# EAGLE design motor_control_cape (EAGLE 7.7.0)

## Sheet 1 of 5
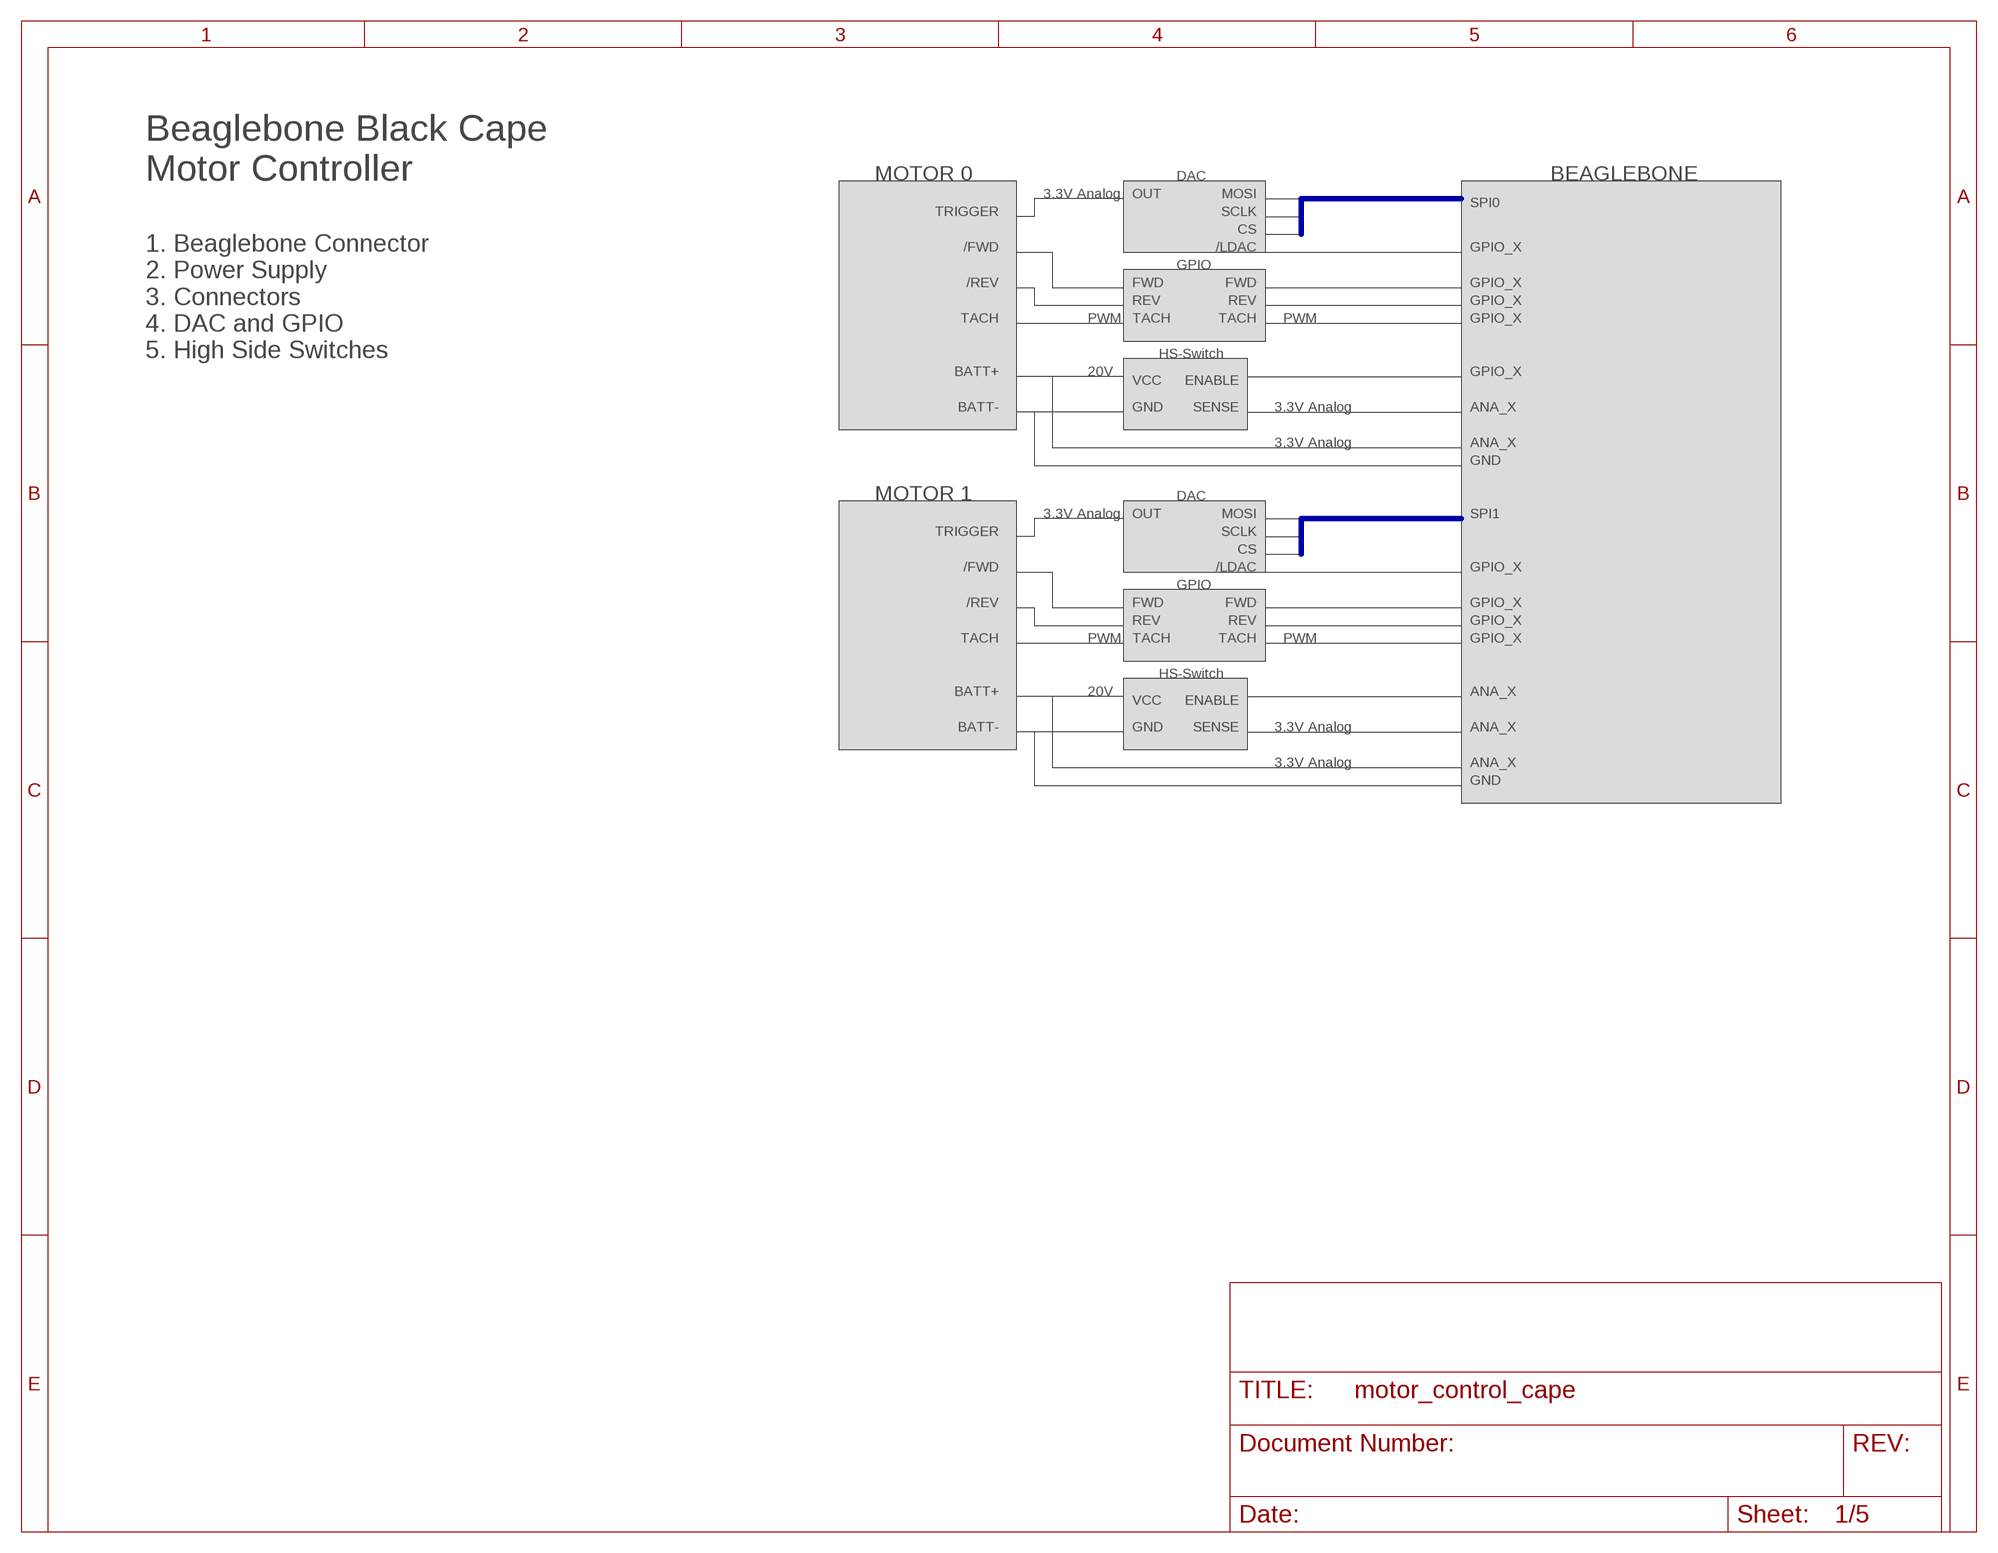
[diagram p0: schematic, sheet 1]

### Buses
B$1

### Notes on the sheet
- Beaglebone Black Cape
  Motor Controller
- MOTOR 0 | DAC | BEAGLEBONE
- 3.3V Analog | OUT | MOSI
- SPI0
- TRIGGER | SCLK
- 1. Beaglebone Connector
  2. Power Supply
  3. Connectors
  4. DAC and GPIO
  5. High Side Switches
- CS
- /FWD | /LDAC | GPIO_X
- GPIO
- /REV | FWD | FWD | GPIO_X
- REV | REV | GPIO_X
- TACH | PWM | TACH | TACH | PWM | GPIO_X
- HS-Switch
- BATT+ | 20V | GPIO_X
- VCC | ENABLE
- BATT- | GND | SENSE | 3.3V Analog | ANA_X
- 3.3V Analog | ANA_X
- GND
- MOTOR 1 | DAC
- 3.3V Analog | OUT | MOSI | SPI1
- TRIGGER | SCLK
- CS
- /FWD | /LDAC | GPIO_X
- GPIO
- /REV | FWD | FWD | GPIO_X
- REV | REV | GPIO_X
- TACH | PWM | TACH | TACH | PWM | GPIO_X
- HS-Switch
- BATT+ | 20V | ANA_X
- VCC | ENABLE
- BATT- | GND | SENSE | 3.3V Analog | ANA_X
- 3.3V Analog | ANA_X
- GND

## Sheet 2 of 5
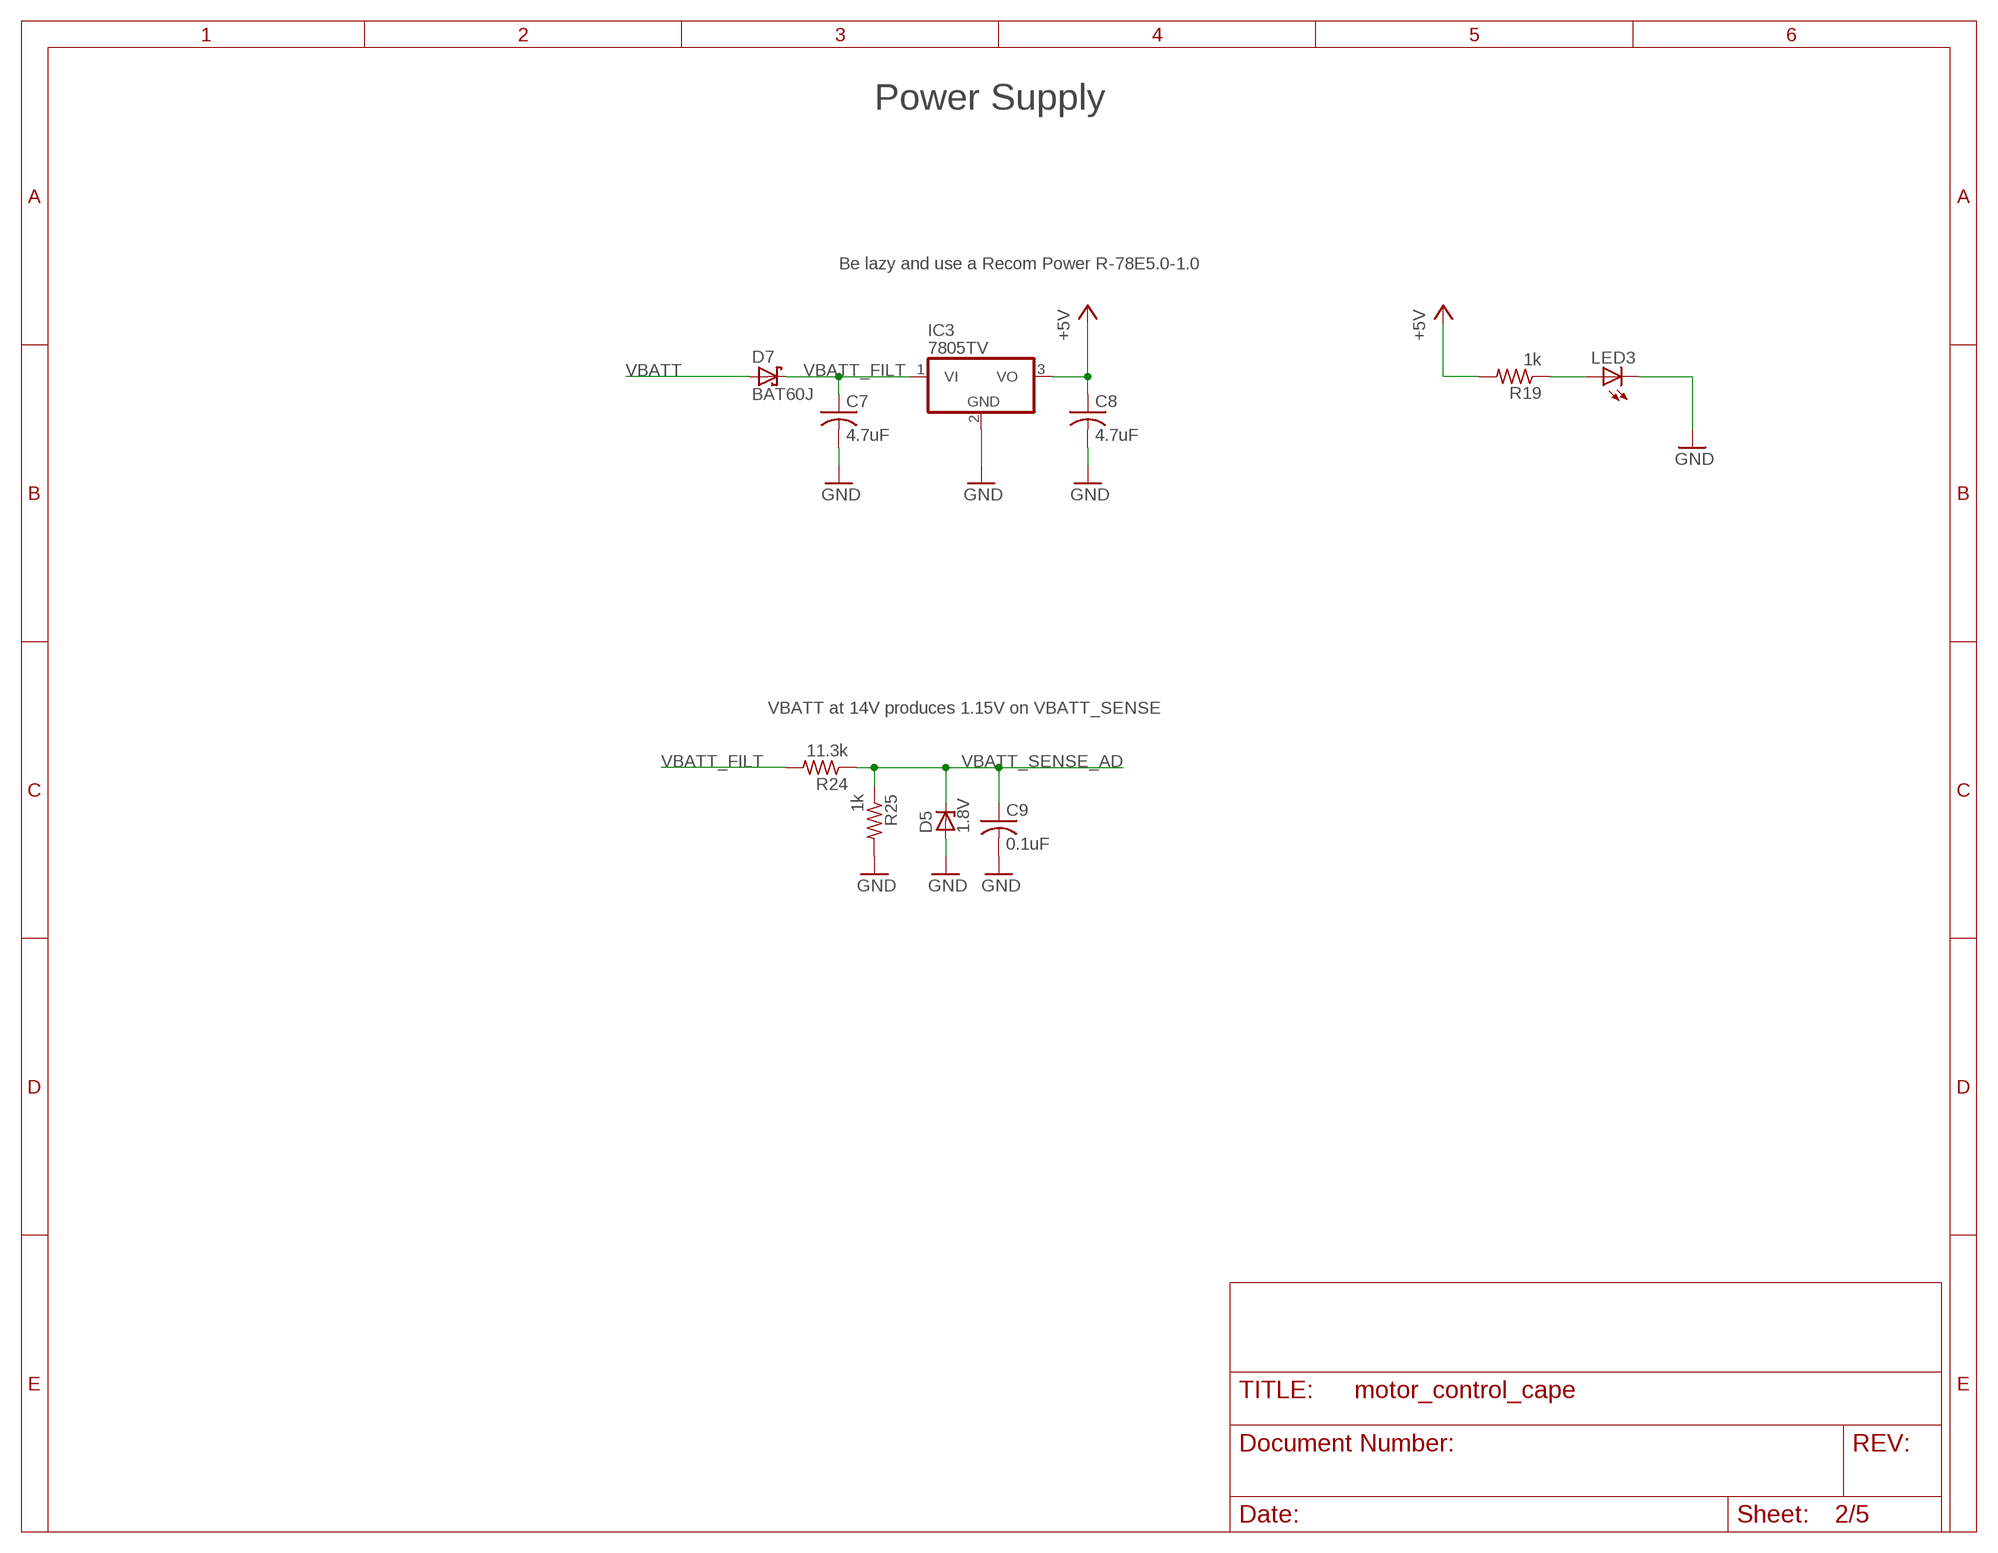
[diagram p1: schematic, sheet 2]

### Parts
C7  4.7uF  C-USC0805  [C0805]
C8  4.7uF  C-USC0805  [C0805]
C9  0.1uF  C-USC0603  [C0603]
D5  1.8V  ZENER-DIODESOT23  [SOT23]
D7  BAT60J  [SOD323_ST]
IC3  7805TV  [TO220V]
LED3  LEDCHIPLED_0603  [CHIPLED_0603]
R19  1k  R-US_R0603  [R0603]
R24  11.3k  R-US_R0603  [R0603]
R25  1k  R-US_R0603  [R0603]

### Nets
+5V: C8.1 IC3.3(VO) R19.2 ; also sheet 3
GND: C7.2 C8.2 C9.2 D5.1(A) IC3.2(GND) LED3.C R25.2 ; also sheet 3,4,5
N$7: LED3.A R19.1
VBATT: D7.A ; also sheet 3
VBATT_FILT: C7.1 D7.C IC3.1(VI) R24.2
VBATT_SENSE_AD: C9.1 D5.3(C) R24.1 R25.1 ; also sheet 3

### Notes on the sheet
- Power Supply
- Be lazy and use a Recom Power R-78E5.0-1.0
- VBATT at 14V produces 1.15V on VBATT_SENSE

## Sheet 3 of 5
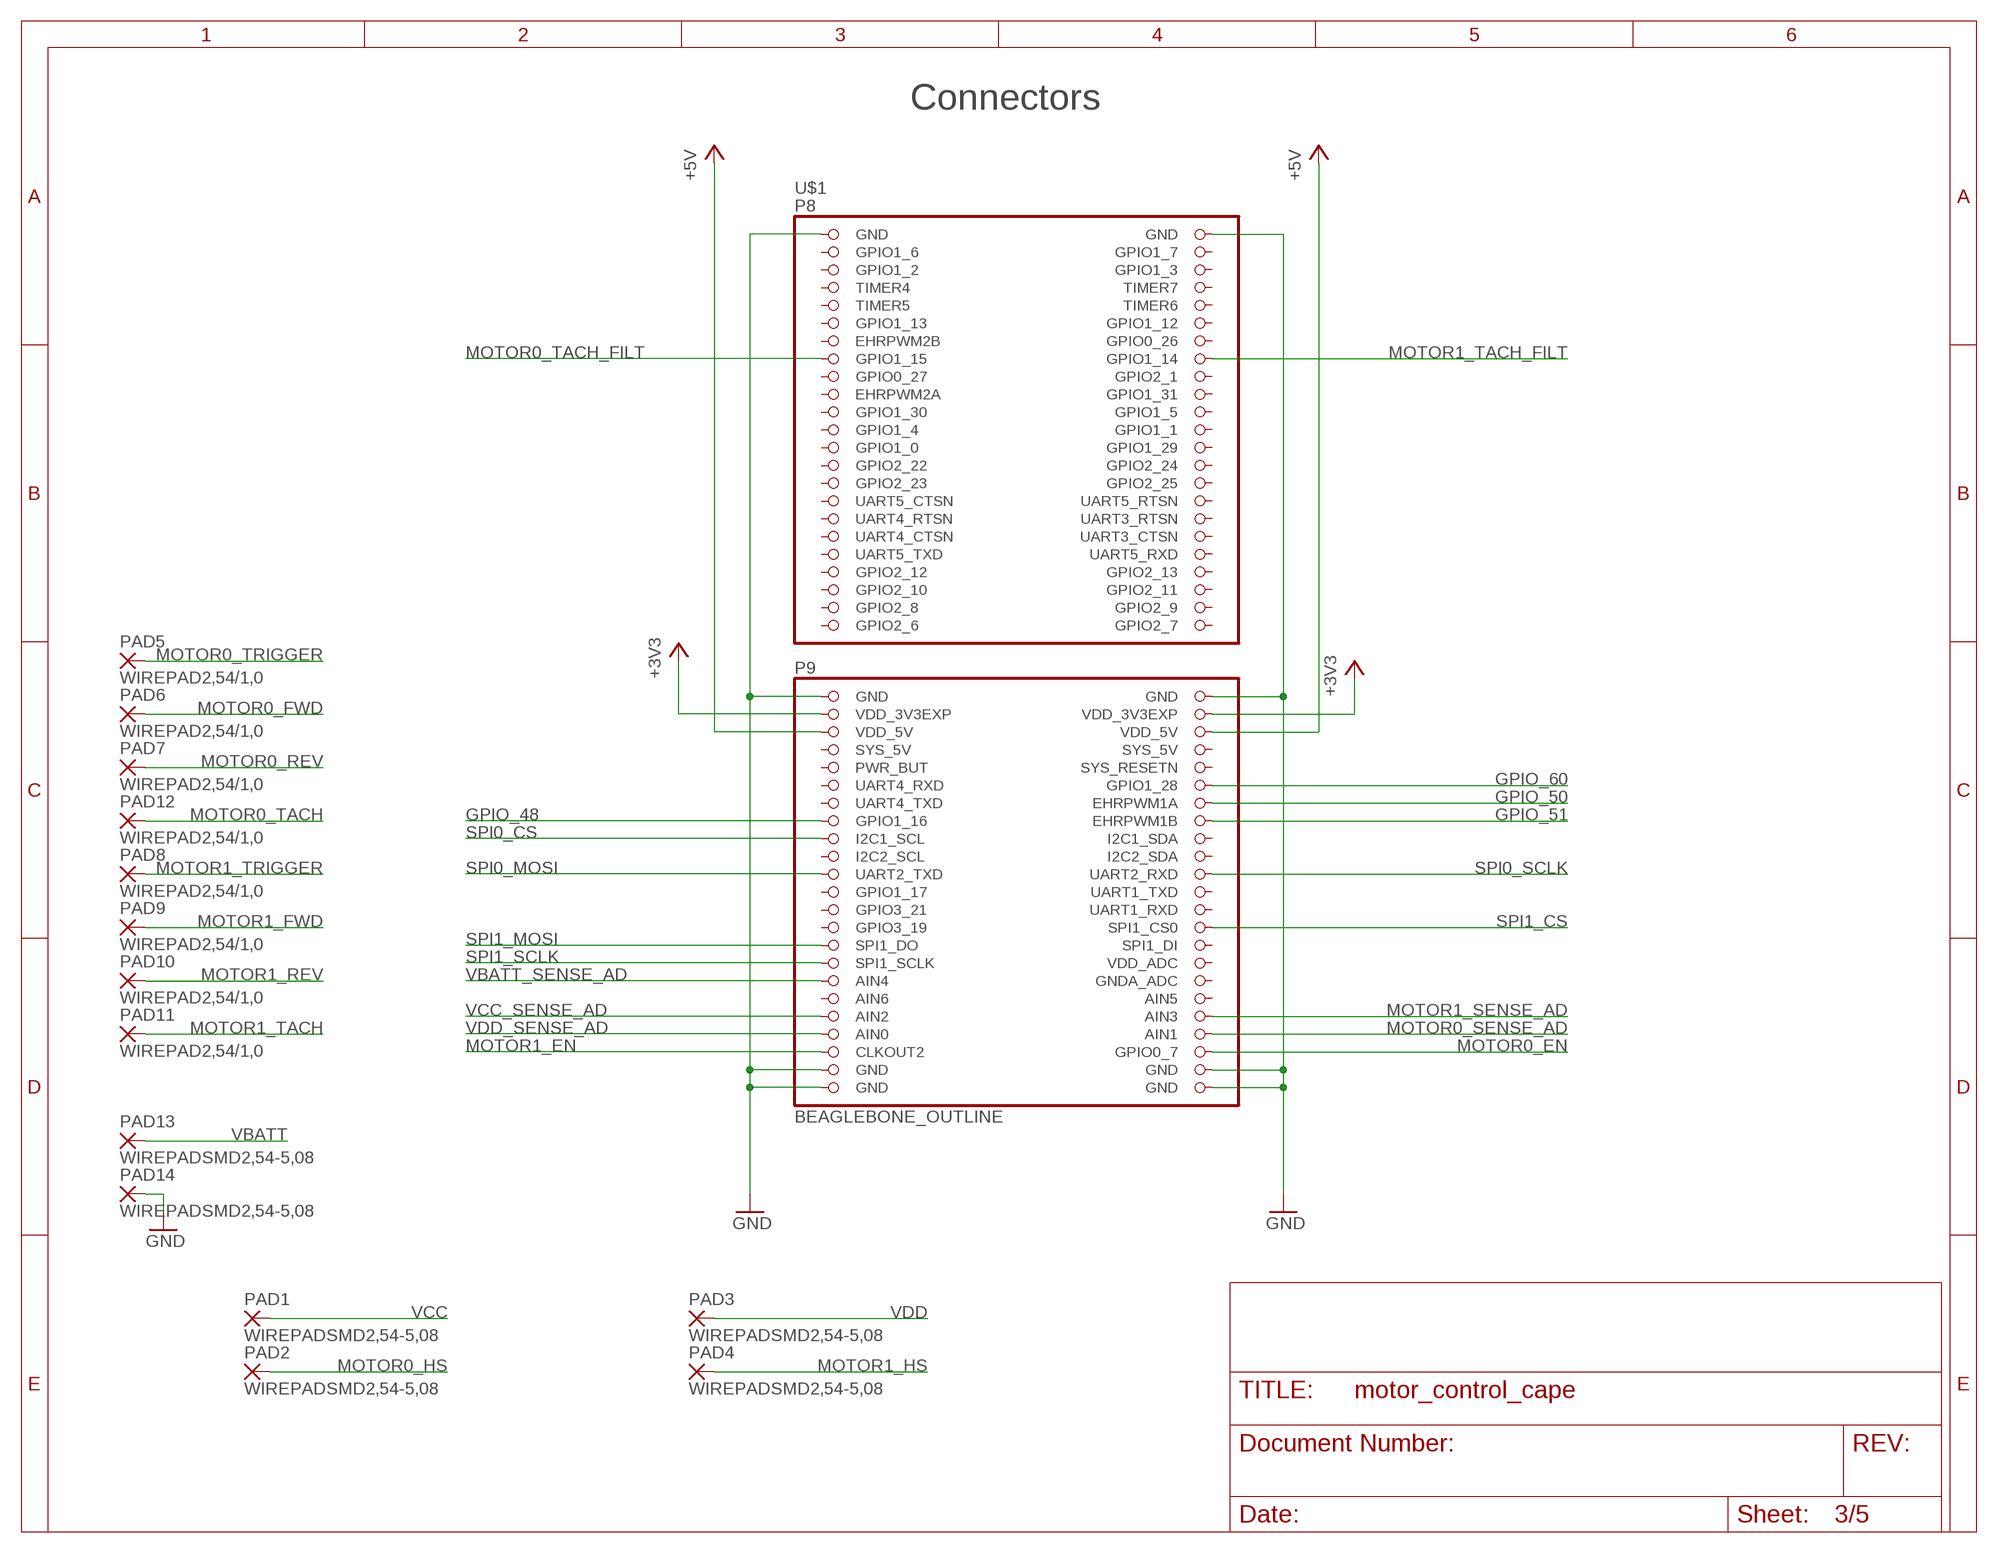
[diagram p2: schematic, sheet 3]

### Parts
PAD1  WIREPADSMD2,54-5,08  [SMD2,54-5,08]
PAD2  WIREPADSMD2,54-5,08  [SMD2,54-5,08]
PAD3  WIREPADSMD2,54-5,08  [SMD2,54-5,08]
PAD4  WIREPADSMD2,54-5,08  [SMD2,54-5,08]
PAD5  WIREPAD2,54/1,0  [2,54/1,0]
PAD6  WIREPAD2,54/1,0  [2,54/1,0]
PAD7  WIREPAD2,54/1,0  [2,54/1,0]
PAD8  WIREPAD2,54/1,0  [2,54/1,0]
PAD9  WIREPAD2,54/1,0  [2,54/1,0]
PAD10  WIREPAD2,54/1,0  [2,54/1,0]
PAD11  WIREPAD2,54/1,0  [2,54/1,0]
PAD12  WIREPAD2,54/1,0  [2,54/1,0]
PAD13  WIREPADSMD2,54-5,08  [SMD2,54-5,08]
PAD14  WIREPADSMD2,54-5,08  [SMD2,54-5,08]
U$1  BEAGLEBONE_OUTLINE  [BEAGLEBONE_SHIELD]

### Nets
+3V3: U$1.49(VDD_3V3EXP) U$1.50(VDD_3V3EXP) ; also sheet 4
+5V: U$1.51(VDD_5V) U$1.52(VDD_5V) ; also sheet 2
GND: PAD14.1(P) U$1.1(GND) U$1.2(GND) U$1.47(GND) U$1.48(GND) U$1.89(GND) U$1.90(GND) U$1.91(GND) U$1.92(GND) ; also sheet 2,4,5
GPIO_48: U$1.61(GPIO1_16) ; also sheet 4
GPIO_50: U$1.60(EHRPWM1A) ; also sheet 4
GPIO_51: U$1.62(EHRPWM1B) ; also sheet 4
GPIO_60: U$1.58(GPIO1_28) ; also sheet 4
MOTOR0_EN: U$1.88(GPIO0_7) ; also sheet 5
MOTOR0_FWD: PAD6.1(P) ; also sheet 4
MOTOR0_HS: PAD2.1(P) ; also sheet 5
MOTOR0_REV: PAD7.1(P) ; also sheet 4
MOTOR0_SENSE_AD: U$1.86(AIN1) ; also sheet 5
MOTOR0_TACH: PAD12.1(P) ; also sheet 4
MOTOR0_TACH_FILT: U$1.15(GPIO1_15) ; also sheet 4
MOTOR0_TRIGGER: PAD5.1(P) ; also sheet 4
MOTOR1_EN: U$1.87(CLKOUT2) ; also sheet 5
MOTOR1_FWD: PAD9.1(P) ; also sheet 4
MOTOR1_HS: PAD4.1(P) ; also sheet 5
MOTOR1_REV: PAD10.1(P) ; also sheet 4
MOTOR1_SENSE_AD: U$1.84(AIN3) ; also sheet 5
MOTOR1_TACH: PAD11.1(P) ; also sheet 4
MOTOR1_TACH_FILT: U$1.16(GPIO1_14) ; also sheet 4
MOTOR1_TRIGGER: PAD8.1(P) ; also sheet 4
SPI0_CS: U$1.63(I2C1_SCL) ; also sheet 4
SPI0_MOSI: U$1.67(UART2_TXD) ; also sheet 4
SPI0_SCLK: U$1.68(UART2_RXD) ; also sheet 4
SPI1_CS: U$1.74(SPI1_CS0) ; also sheet 4
SPI1_MOSI: U$1.75(SPI1_DO) ; also sheet 4
SPI1_SCLK: U$1.77(SPI1_SCLK) ; also sheet 4
VBATT: PAD13.1(P) ; also sheet 2
VBATT_SENSE_AD: U$1.79(AIN4) ; also sheet 2
VCC: PAD1.1(P) ; also sheet 5
VCC_SENSE_AD: U$1.83(AIN2) ; also sheet 5
VDD: PAD3.1(P) ; also sheet 5
VDD_SENSE_AD: U$1.85(AIN0) ; also sheet 5
Unconnected: U$1.3(GPIO1_6) U$1.4(GPIO1_7) U$1.5(GPIO1_2) U$1.6(GPIO1_3) U$1.7(TIMER4) U$1.8(TIMER7) U$1.9(TIMER5) U$1.10(TIMER6) U$1.11(GPIO1_13) U$1.12(GPIO1_12) U$1.13(EHRPWM2B) U$1.14(GPIO0_26) U$1.17(GPIO0_27) U$1.18(GPIO2_1) U$1.19(EHRPWM2A) U$1.20(GPIO1_31) U$1.21(GPIO1_30) U$1.22(GPIO1_5) U$1.23(GPIO1_4) U$1.24(GPIO1_1) U$1.25(GPIO1_0) U$1.26(GPIO1_29) U$1.27(GPIO2_22) U$1.28(GPIO2_24) U$1.29(GPIO2_23) U$1.30(GPIO2_25) U$1.31(UART5_CTSN) U$1.32(UART5_RTSN) U$1.33(UART4_RTSN) U$1.34(UART3_RTSN) U$1.35(UART4_CTSN) U$1.36(UART3_CTSN) U$1.37(UART5_TXD) U$1.38(UART5_RXD) U$1.39(GPIO2_12) U$1.40(GPIO2_13) U$1.41(GPIO2_10) U$1.42(GPIO2_11) U$1.43(GPIO2_8) U$1.44(GPIO2_9) U$1.45(GPIO2_6) U$1.46(GPIO2_7) U$1.54(SYS_5V) U$1.55(PWR_BUT) U$1.56(SYS_RESETN) U$1.57(UART4_RXD) U$1.59(UART4_TXD) U$1.64(I2C1_SDA) U$1.65(I2C2_SCL) U$1.66(I2C2_SDA) U$1.69(GPIO1_17) U$1.70(UART1_TXD) U$1.71(GPIO3_21) U$1.72(UART1_RXD) U$1.73(GPIO3_19) U$1.76(SPI1_DI) U$1.78(VDD_ADC) U$1.80(GNDA_ADC) U$1.81(AIN6) U$1.82(AIN5)

### Notes on the sheet
- Connectors

## Sheet 4 of 5
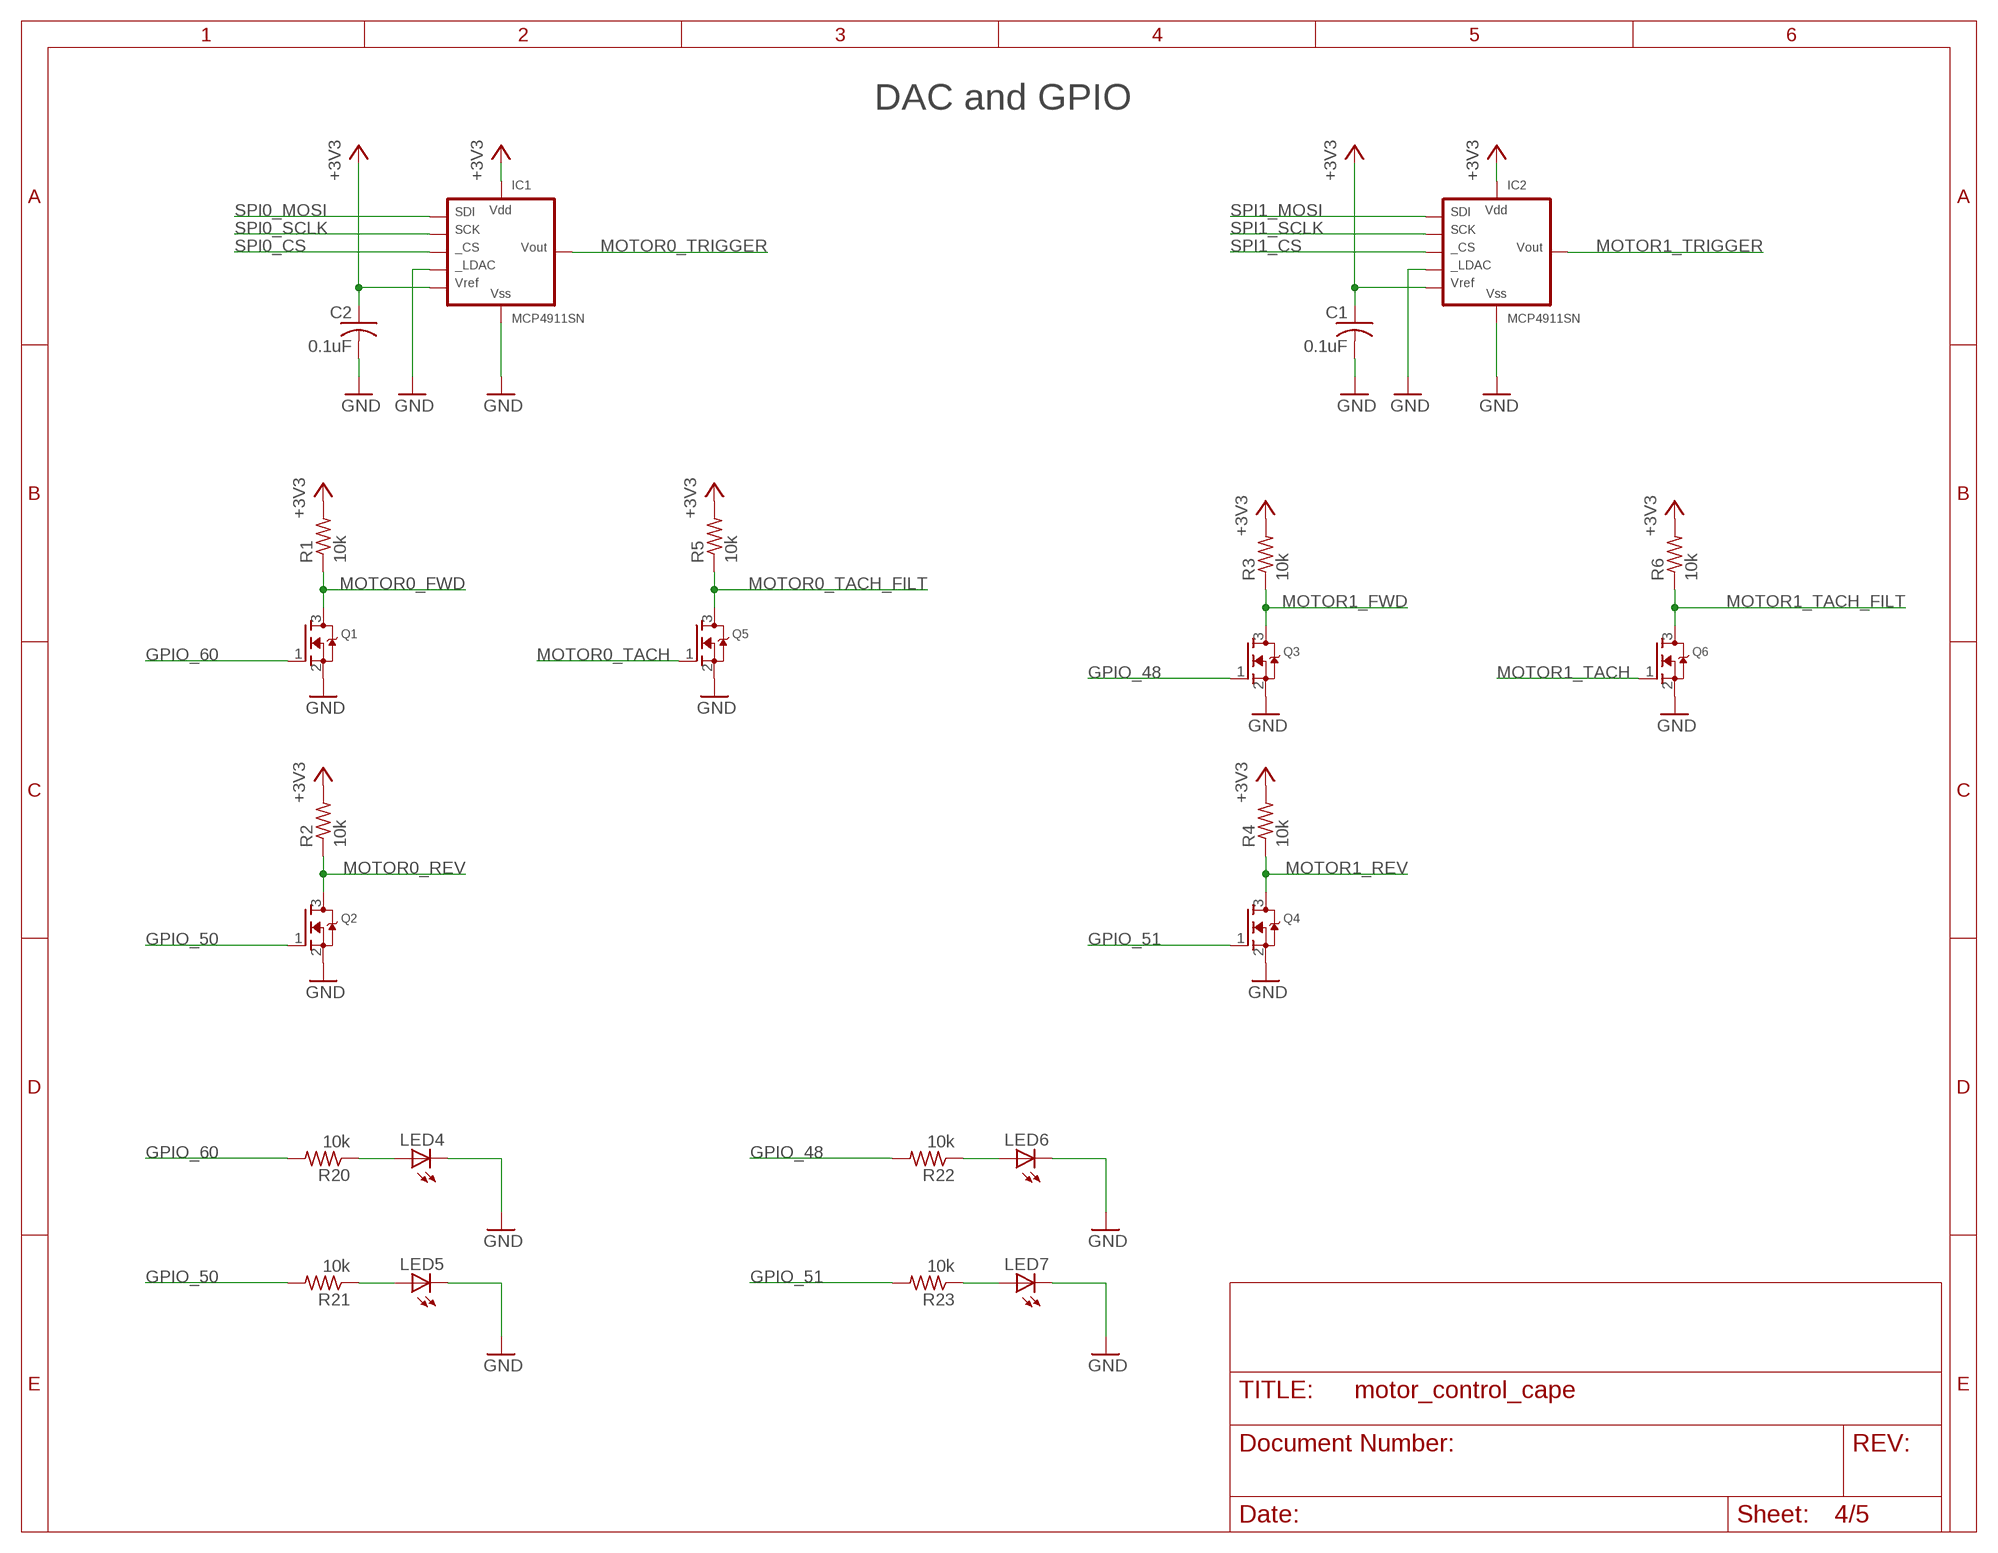
[diagram p3: schematic, sheet 4]

### Parts
C1  0.1uF  C-USC0603  [C0603]
C2  0.1uF  C-USC0603  [C0603]
IC1  MCP4911SN  [SO-08]
IC2  MCP4911SN  [SO-08]
LED4  LEDCHIPLED_0603  [CHIPLED_0603]
LED5  LEDCHIPLED_0603  [CHIPLED_0603]
LED6  LEDCHIPLED_0603  [CHIPLED_0603]
LED7  LEDCHIPLED_0603  [CHIPLED_0603]
Q1  MOSFET-NREFLOW  [SOT23]
Q2  MOSFET-NREFLOW  [SOT23]
Q3  MOSFET-NREFLOW  [SOT23]
Q4  MOSFET-NREFLOW  [SOT23]
Q5  MOSFET-NREFLOW  [SOT23]
Q6  MOSFET-NREFLOW  [SOT23]
R1  10k  R-US_R0603  [R0603]
R2  10k  R-US_R0603  [R0603]
R3  10k  R-US_R0603  [R0603]
R4  10k  R-US_R0603  [R0603]
R5  10k  R-US_R0603  [R0603]
R6  10k  R-US_R0603  [R0603]
R20  10k  R-US_R0603  [R0603]
R21  10k  R-US_R0603  [R0603]
R22  10k  R-US_R0603  [R0603]
R23  10k  R-US_R0603  [R0603]

### Nets
+3V3: C1.1 C2.1 IC1.1(VDD) IC1.6(VREF) IC2.1(VDD) IC2.6(VREF) R1.2 R2.2 R3.2 R4.2 R5.2 R6.2 ; also sheet 3
GND: C1.2 C2.2 IC1.5(LDAC) IC1.7(VSS) IC2.5(LDAC) IC2.7(VSS) LED4.C LED5.C LED6.C LED7.C Q1.2(S) Q2.2(S) Q3.2(S) Q4.2(S) Q5.2(S) Q6.2(S) ; also sheet 2,3,5
GPIO_48: Q3.1(G) R22.2 ; also sheet 3
GPIO_50: Q2.1(G) R21.2 ; also sheet 3
GPIO_51: Q4.1(G) R23.2 ; also sheet 3
GPIO_60: Q1.1(G) R20.2 ; also sheet 3
MOTOR0_FWD: Q1.3(D) R1.1 ; also sheet 3
MOTOR0_REV: Q2.3(D) R2.1 ; also sheet 3
MOTOR0_TACH: Q5.1(G) ; also sheet 3
MOTOR0_TACH_FILT: Q5.3(D) R5.1 ; also sheet 3
MOTOR0_TRIGGER: IC1.8(VOUT) ; also sheet 3
MOTOR1_FWD: Q3.3(D) R3.1 ; also sheet 3
MOTOR1_REV: Q4.3(D) R4.1 ; also sheet 3
MOTOR1_TACH: Q6.1(G) ; also sheet 3
MOTOR1_TACH_FILT: Q6.3(D) R6.1 ; also sheet 3
MOTOR1_TRIGGER: IC2.8(VOUT) ; also sheet 3
N$8: LED4.A R20.1
N$9: LED5.A R21.1
N$10: LED6.A R22.1
N$11: LED7.A R23.1
SPI0_CS: IC1.2(CS) ; also sheet 3
SPI0_MOSI: IC1.4(SDI) ; also sheet 3
SPI0_SCLK: IC1.3(SCK) ; also sheet 3
SPI1_CS: IC2.2(CS) ; also sheet 3
SPI1_MOSI: IC2.4(SDI) ; also sheet 3
SPI1_SCLK: IC2.3(SCK) ; also sheet 3

### Notes on the sheet
- DAC and GPIO

## Sheet 5 of 5
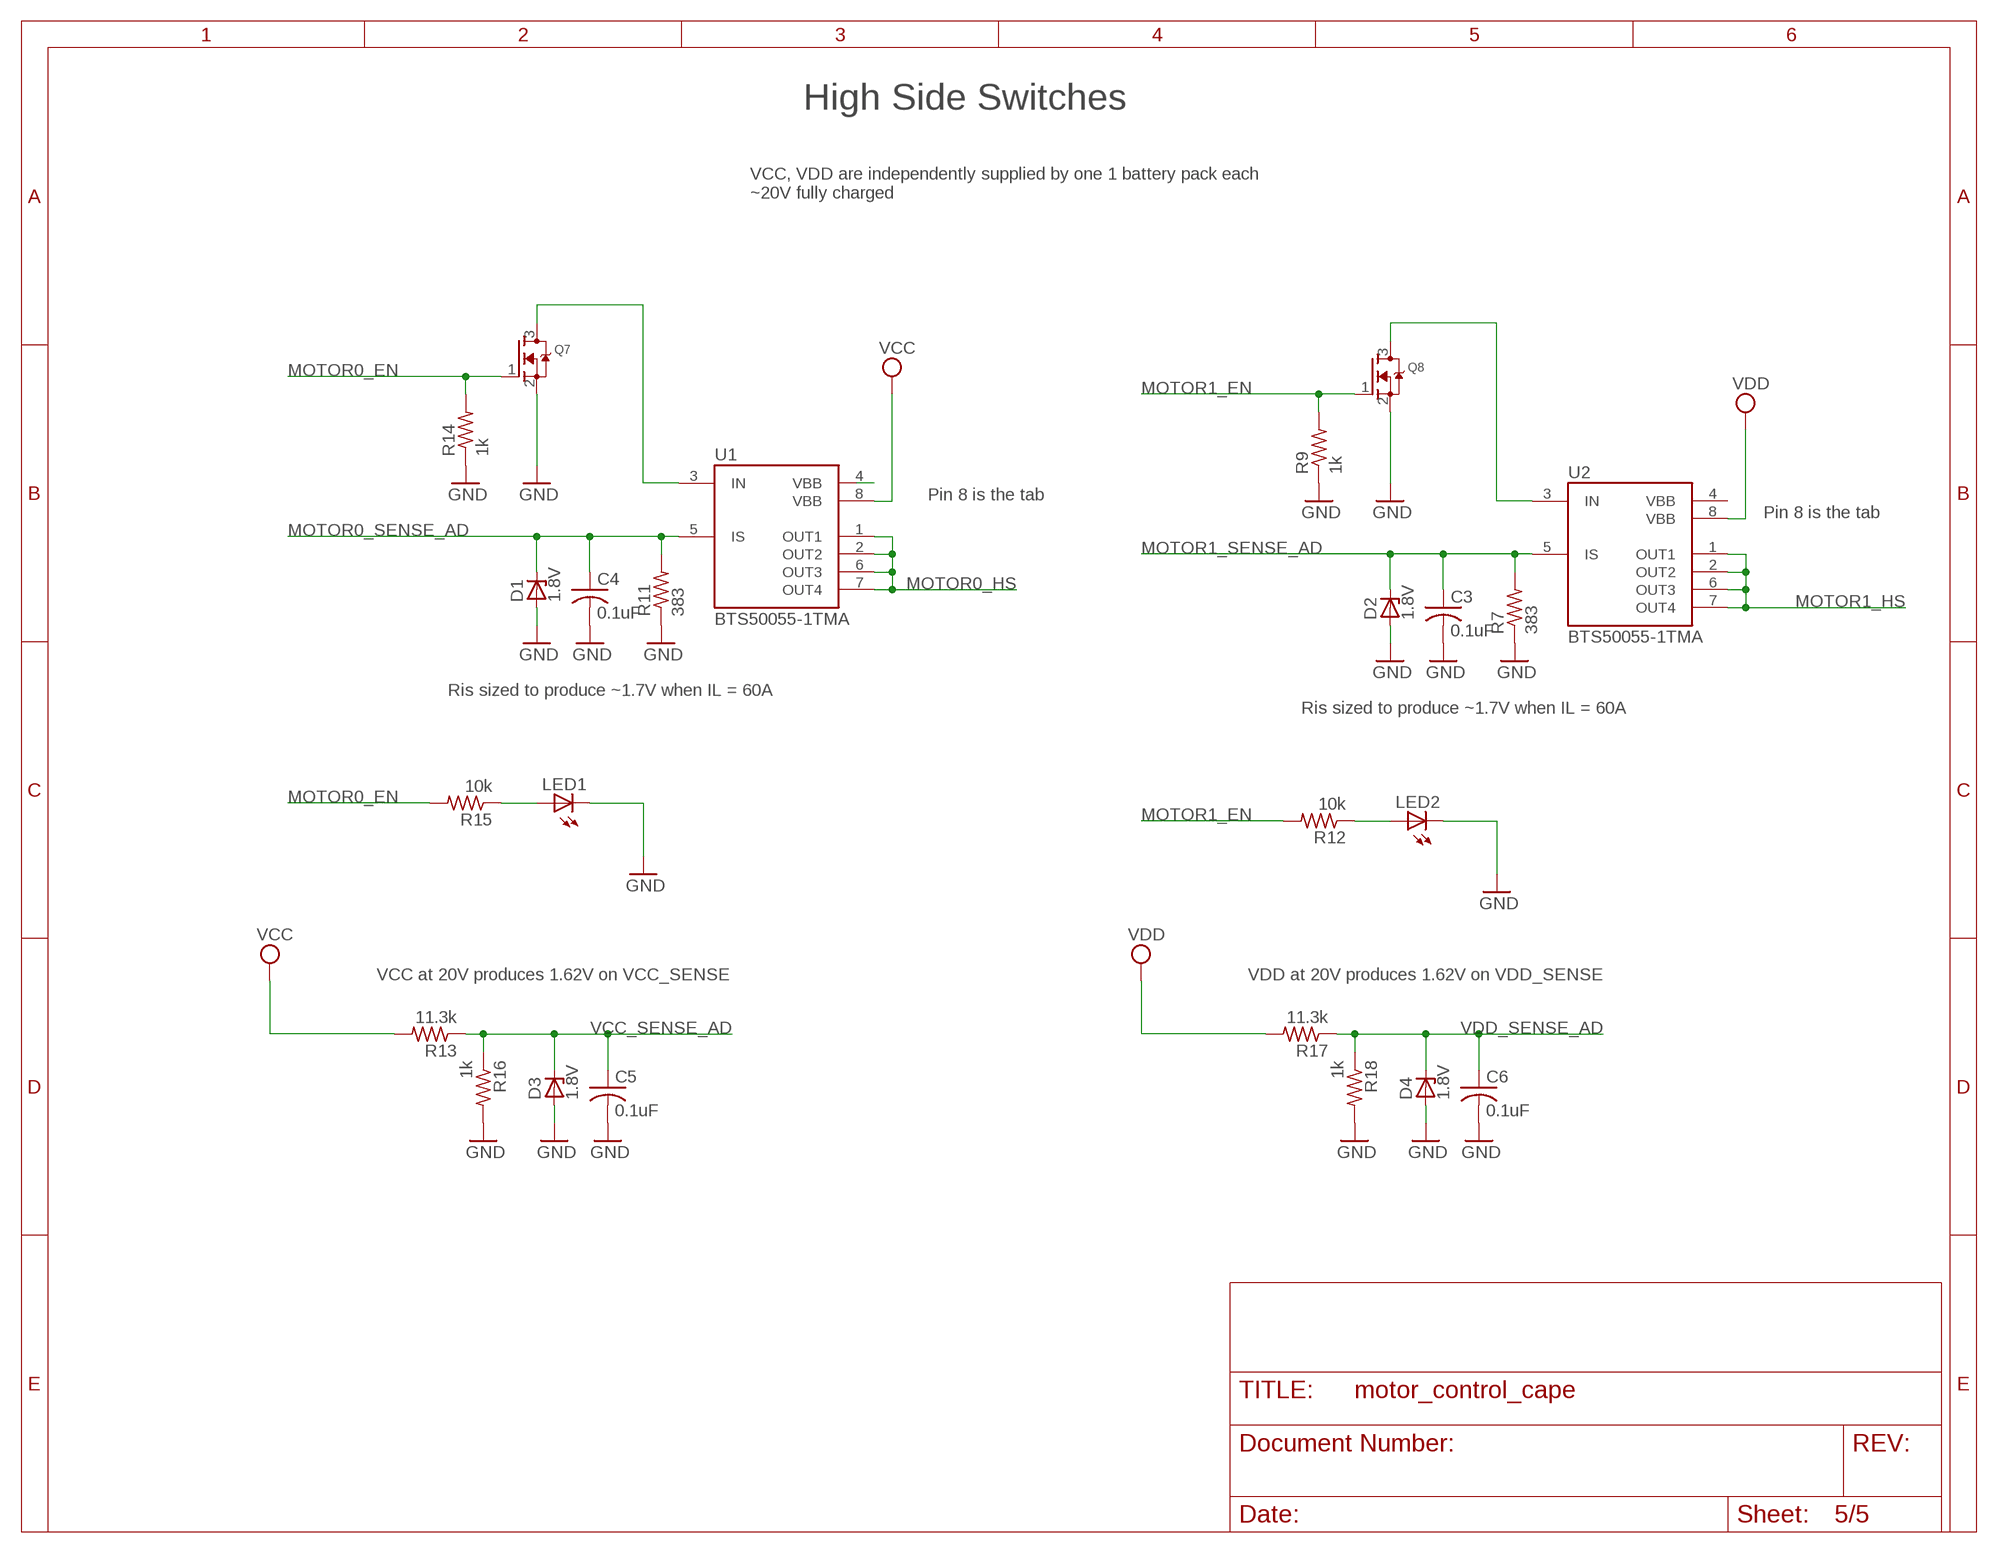
[diagram p4: schematic, sheet 5]

### Parts
C3  0.1uF  C-USC0603  [C0603]
C4  0.1uF  C-USC0603  [C0603]
C5  0.1uF  C-USC0603  [C0603]
C6  0.1uF  C-USC0603  [C0603]
D1  1.8V  ZENER-DIODESOT23  [SOT23]
D2  1.8V  ZENER-DIODESOT23  [SOT23]
D3  1.8V  ZENER-DIODESOT23  [SOT23]
D4  1.8V  ZENER-DIODESOT23  [SOT23]
LED1  LEDCHIPLED_0603  [CHIPLED_0603]
LED2  LEDCHIPLED_0603  [CHIPLED_0603]
Q7  MOSFET-NREFLOW  [SOT23]
Q8  MOSFET-NREFLOW  [SOT23]
R7  383  R-US_R0603  [R0603]
R9  1k  R-US_R0603  [R0603]
R11  383  R-US_R0603  [R0603]
R12  10k  R-US_R0603  [R0603]
R13  11.3k  R-US_R0603  [R0603]
R14  1k  R-US_R0603  [R0603]
R15  10k  R-US_R0603  [R0603]
R16  1k  R-US_R0603  [R0603]
R17  11.3k  R-US_R0603  [R0603]
R18  1k  R-US_R0603  [R0603]
U1  BTS50055-1TMA  [TO127P1385X450-8N-V]
U2  BTS50055-1TMA  [TO127P1385X450-8N-V]

### Nets
GND: C3.2 C4.2 C5.2 C6.2 D1.1(A) D2.1(A) D3.1(A) D4.1(A) LED1.C LED2.C Q7.2(S) Q8.2(S) R7.1 R9.1 R11.1 R14.1 R16.2 R18.2 ; also sheet 2,3,4
MOTOR0_EN: Q7.1(G) R14.2 R15.2 ; also sheet 3
MOTOR0_HS: U1.1(OUT1) U1.2(OUT2) U1.6(OUT3) U1.7(OUT4) ; also sheet 3
MOTOR0_SENSE_AD: C4.1 D1.3(C) R11.2 U1.5(IS) ; also sheet 3
MOTOR1_EN: Q8.1(G) R9.2 R12.2 ; also sheet 3
MOTOR1_HS: U2.1(OUT1) U2.2(OUT2) U2.6(OUT3) U2.7(OUT4) ; also sheet 3
MOTOR1_SENSE_AD: C3.1 D2.3(C) R7.2 U2.5(IS) ; also sheet 3
N$1: U1.4(VBB)
N$2: Q8.3(D) U2.3(IN)
N$3: LED2.A R12.1
N$5: Q7.3(D) U1.3(IN)
N$6: LED1.A R15.1
VCC: R13.2 U1.8(VBB) ; also sheet 3
VCC_SENSE_AD: C5.1 D3.3(C) R13.1 R16.1 ; also sheet 3
VDD: R17.2 U2.8(VBB) ; also sheet 3
VDD_SENSE_AD: C6.1 D4.3(C) R17.1 R18.1 ; also sheet 3

### Notes on the sheet
- High Side Switches
- VCC, VDD are independently supplied by one 1 battery pack each
  ~20V fully charged
- Pin 8 is the tab
- Pin 8 is the tab
- Ris sized to produce ~1.7V when IL = 60A
- Ris sized to produce ~1.7V when IL = 60A
- VCC at 20V produces 1.62V on VCC_SENSE | VDD at 20V produces 1.62V on VDD_SENSE

## Power pins joined to a net without a drawn wire
SYS_5V: U$1.53(SYS_5V)
VBB: U2.4(VBB)

## Library data of the parts
C1-C9 = resistor:C-US: CAPACITOR, American symbol
D1-D5 = diode:ZENER-DIODE: Z-Diode
D7 = diode:BAT60J: Schottky barrier diode Source: www.st.com, BAT60J.pdf
IC1 IC2 = microchip-dac:MCP4911: MCP4911: 10-bit DAC MCP4901/4911/4921 - 8/10/12-Bit Voltage Output Digital-to-Analog Converter with SPI Interface Interface The MCP49x1 devices are single channel 8-bit, 10-bit and 12-bit buffered voltage output Digital-to-Analog Converters (DACs), respectively. The devices operate from a single 2.7V to 5.5V supply with an SPI compatible Serial Peripheral Interface. The user can configure the full-scale range of the device to be VREF or 2*VREF by setting the Gain Selection Option bit (gain of 1 of 2). RobG
IC3 = linear:78*: Positive VOLTAGE REGULATOR Source: http://cache.national.com/ds/LM/LM78L05.pdf http://www.fairchildsemi.com/ds/LM/LM7805.pdf
LED1-LED7 = adafruit:LED: LED OSRAM: - CHIPLED LG R971, LG N971, LY N971, LG Q971, LY Q971, LO R971, LY R971 LH N974, LH R974 LS Q976, LO Q976, LY Q976 LO Q996 - Hyper CHIPLED LW Q18S LB Q993, LB Q99A, LB R99A - SideLED LS A670, LO A670, LY A670, LG A670, LP A670 LB A673, LV A673, LT A673, LW A673 LH A674 LY A675 LS A676, LA A676, LO A676, LY A676, LW A676 LS A679, LY A679, LG A679 - Hyper Micro SIDELED® LS Y876, LA Y876, LO Y876, LY Y876 LT Y87S - SmartLED LW L88C, LW L88S LB L89C, LB L89S, LG L890 LS L89K, LO L89K, LY L89K LS L896, LA L896, LO L896, LY L896 - TOPLED LS T670, LO T670, LY T670, LG T670, LP T670 LSG T670, LSP T670, LSY T670, LOP T670, LYG T670 LG T671, LOG T671, LSG T671 LB T673, LV T673, LT T673, LW T673 LH T674 LS T676, LA T676, LO T676, LY T676, LB T676, LH T676, LSB T676, LW T676 LB T67C, LV T67C, LT T67C, LS T67K, LO T67K, LY T67K, LW E67C LS E67B, LA E67B, LO E67B, LY E67B, LB E67C, LV E67C, LT E67C LW T67C LS T679, LY T679, LG T679 LS T770, LO T770, LY T770, LG T770, LP T770 LB T773, LV T773, LT T773, LW T773 LH T774 LS E675, LA E675, LY E675, LS T675 LS T776, LA T776, LO T776, LY T776, LB T776 LHGB T686 LT T68C, LB T68C - Hyper Mini TOPLED® LB M676 - Mini TOPLED Santana® LG M470 LS M47K, LO M47K, LY M47K Source: http://www.osram.convergy.de/
PAD1-PAD14 = wirepad:WIREPAD: Wire PAD connect wire on PCB
Q1-Q8 = adafruit:MOSFET-N: N-Channel Mosfet 2N7002E - 60V 260mA SOT23 [Digikey: 2N7002ET1GOSTR-ND] - REEL BSH103 - 30V 850mA SOT23 [Digikey: 568-5013-1-ND]
R1-R6 = resistor:R-US_: RESISTOR, American symbol
R7 R9 R11-R25 = rcl:R-US_: RESISTOR, American symbol
U1 U2 = BTS50055-1TMA:BTS50055-1TMA: BTS50055-1TMA Smart Highside High Current Power Switch, VBB 62V TO127P1385X450-8N-V
U$1 = adafruit:BEAGLEBONE_OUTLINE: Should match A3 pinout - but not completely tested

## Board
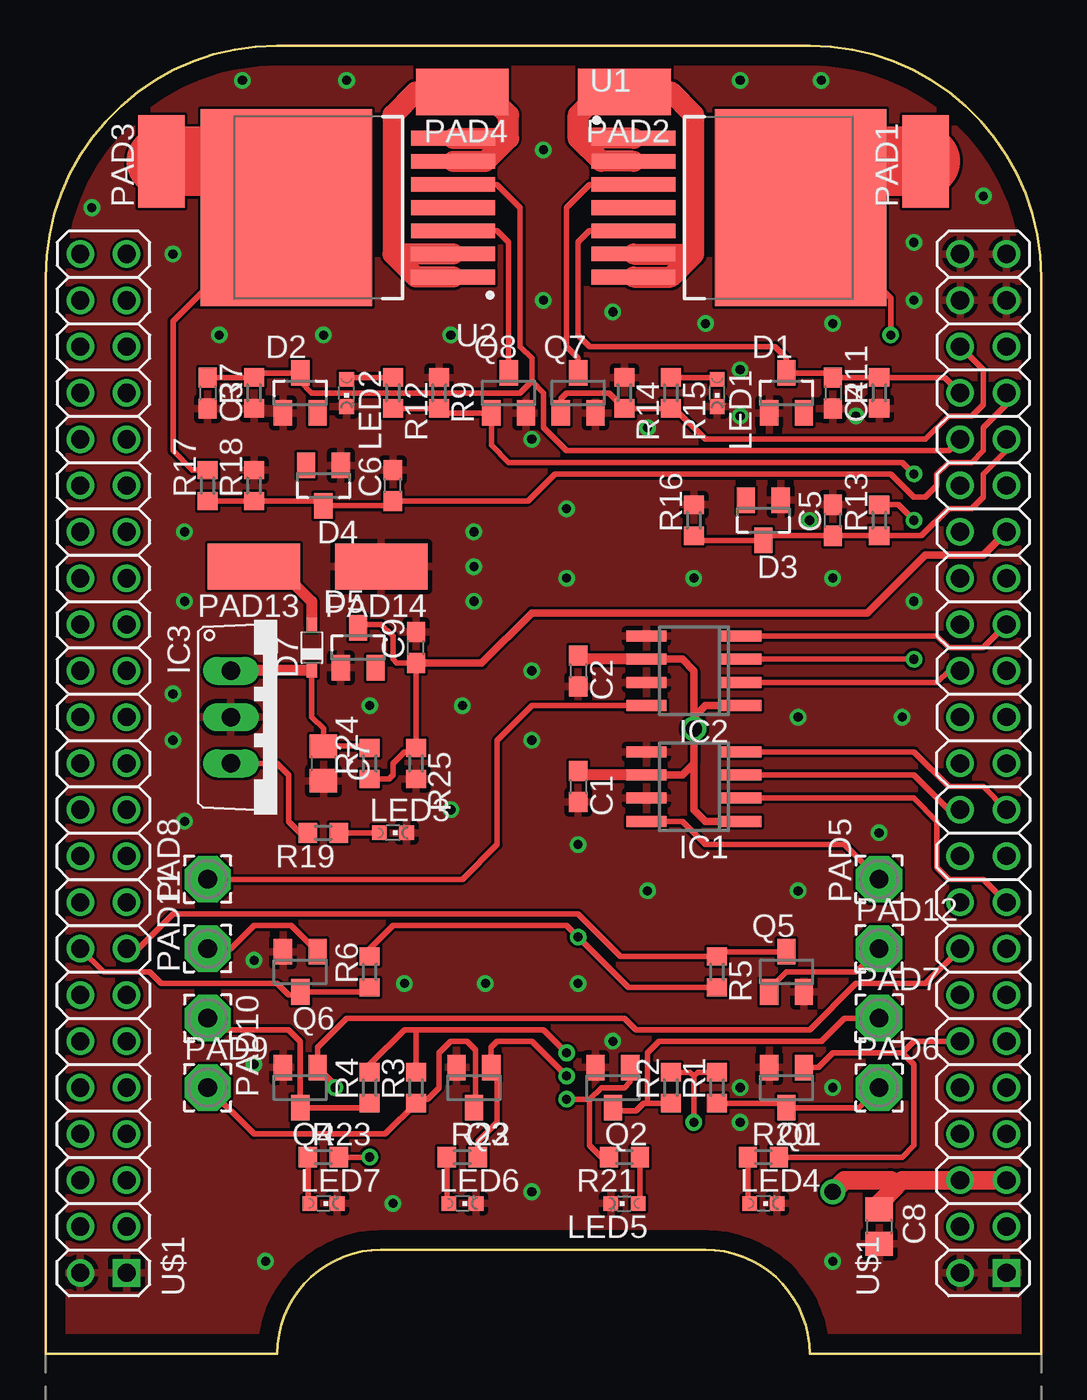
[diagram p5: board, top side]
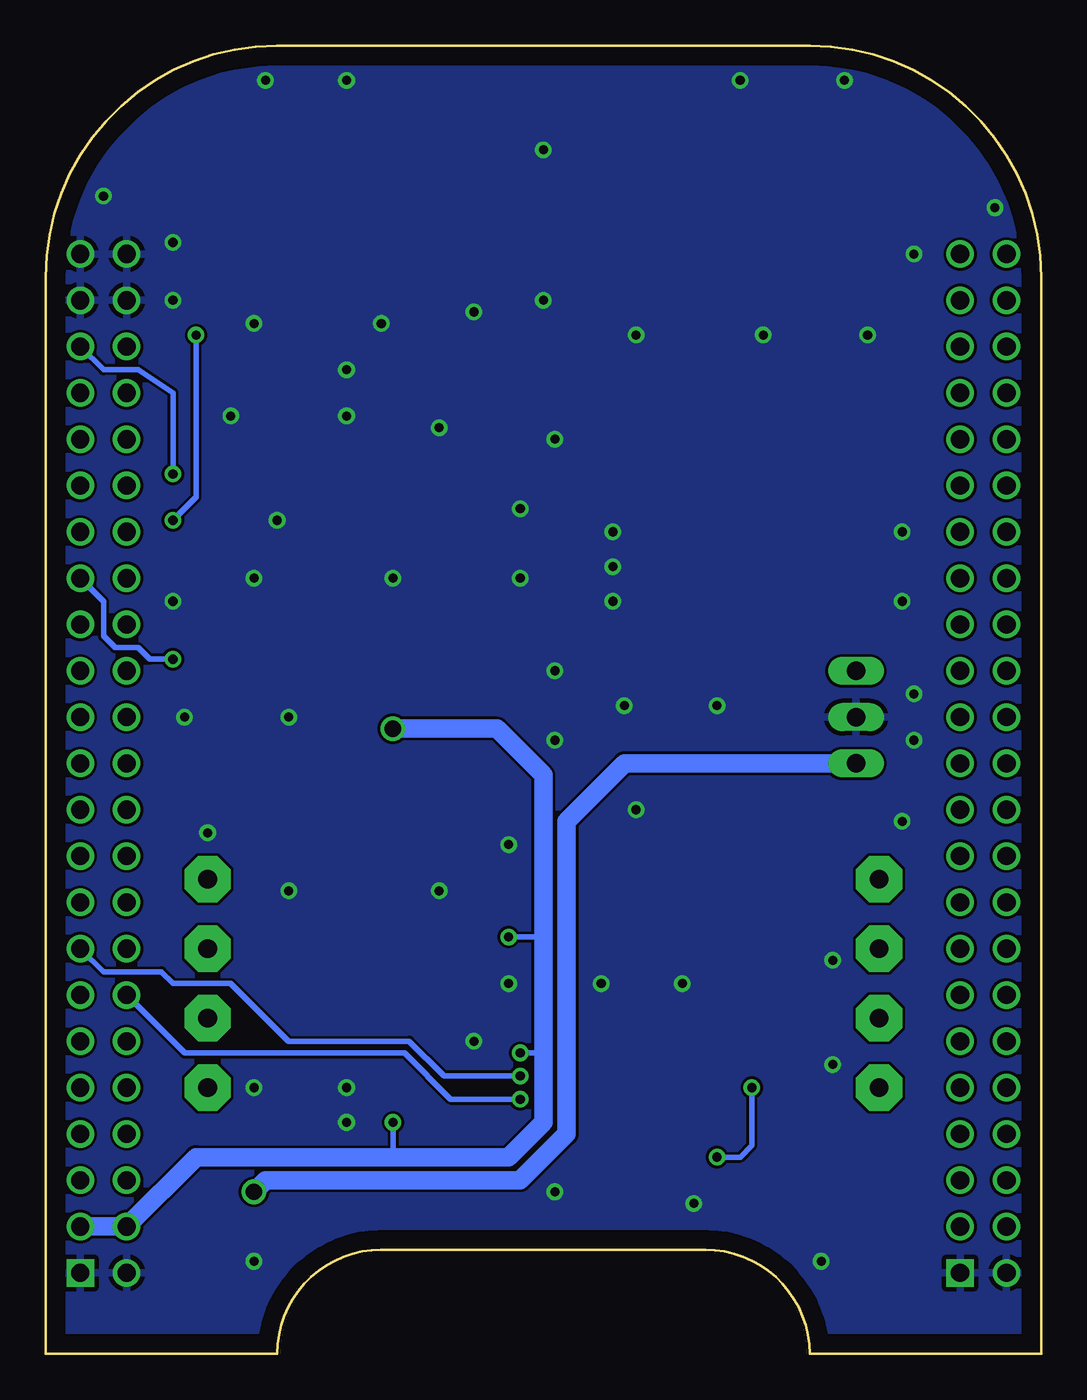
[diagram p6: board, bottom side, seen from below]

Size 54.61 x 71.75 mm. Coordinates in mm from the lower left corner, seen from the top.
Copper layers (1*16): Top 0.035mm / dielectric 1.5mm / Bottom 0.035mm
Design rules "default *": minimum track width 10mil, minimum drill 18mil, track to track 6mil, track to pad 6mil, pad to pad 6mil, via to via 6mil, smd to smd 6mil, copper to edge 40mil, drill to drill 8mil, minimum pad ring 10mil, minimum via ring 8mil, stop-mask expansion 4mil, vias tented up to drill 0mil, thermal gap 10mil

### Footprints (pad centres in the part's own frame; a part is rotated, then mirrored left to right if it is on the bottom)
C0603 = smd 1.1 x 1: 1 -0.85,0; 2 0.85,0
C0805 = smd 1.3 x 1.5: 1 -0.95,0; 2 0.95,0
SOT23 = smd 1 x 1.4: 1 -0.95,-1.1; 2 0.95,-1.1; 3 0,1.1
SOD323_ST = smd 0.8 x 0.6: A 1.25,0; C -1.25,0
SO-08 = smd 0.6 x 2.2: 1 -1.905,-2.6; 2 -0.635,-2.6; 3 0.635,-2.6; 4 1.905,-2.6; 5 1.905,2.6; 6 0.635,2.6; 7 -0.635,2.6; 8 -1.905,2.6
TO220V = drill 1.016 long: 1 -2.54,-2.54; 2 0,-2.54; 3 2.54,-2.54
CHIPLED_0603 = smd 0.8 x 0.8: A 0,-0.75; C 0,0.75
SMD2,54-5,08 = smd 2.54 x 5.08: 1 0,0
2,54/1,0 = drill 1.016 pad 2.54 octagon: 1 0,0
R0603 = smd 1 x 1.1: 1 -0.85,0; 2 0.85,0
TO127P1385X450-8N-V = smd 4.6 x 0.8: 1 -4.575,3.81; 2 -4.575,2.54; 3 -4.575,1.27; 4 -4.575,0; 5 -4.575,-1.27; 6 -4.575,-2.54; 7 -4.575,-3.81 | smd 9.4 x 10.8: 8 4.575,0
BEAGLEBONE_SHIELD = drill 1 square: 1 4.445,19.05; 47 52.705,19.05 | drill 1: 2 1.905,19.05; 3 4.445,21.59; 4 1.905,21.59; 5 4.445,24.13; 6 1.905,24.13; 7 4.445,26.67; 8 1.905,26.67; 9 4.445,29.21; 10 1.905,29.21; 11 4.445,31.75; 12 1.905,31.75; 13 4.445,34.29; 14 1.905,34.29; 15 4.445,36.83; 16 1.905,36.83; 17 4.445,39.37; 18 1.905,39.37; 19 4.445,41.91; 20 1.905,41.91; 21 4.445,44.45; 22 1.905,44.45; 23 4.445,46.99; 24 1.905,46.99; 25 4.445,49.53; 26 1.905,49.53; 27 4.445,52.07; 28 1.905,52.07; 29 4.445,54.61; 30 1.905,54.61; 31 4.445,57.15; 32 1.905,57.15; 33 4.445,59.69; 34 1.905,59.69; 35 4.445,62.23; 36 1.905,62.23; 37 4.445,64.77; 38 1.905,64.77; 39 4.445,67.31; 40 1.905,67.31; 41 4.445,69.85; 42 1.905,69.85; 43 4.445,72.39; 44 1.905,72.39; 45 4.445,74.93; 46 1.905,74.93; 48 50.165,19.05; 49 52.705,21.59; 50 50.165,21.59; 51 52.705,24.13; 52 50.165,24.13; 53 52.705,26.67; 54 50.165,26.67; 55 52.705,29.21; 56 50.165,29.21; 57 52.705,31.75; 58 50.165,31.75; 59 52.705,34.29; 60 50.165,34.29; 61 52.705,36.83; 62 50.165,36.83; 63 52.705,39.37; 64 50.165,39.37; 65 52.705,41.91; 66 50.165,41.91; 67 52.705,44.45; 68 50.165,44.45; 69 52.705,46.99; 70 50.165,46.99; 71 52.705,49.53; 72 50.165,49.53; 73 52.705,52.07; 74 50.165,52.07; 75 52.705,54.61; 76 50.165,54.61; 77 52.705,57.15; 78 50.165,57.15; 79 52.705,59.69; 80 50.165,59.69; 81 52.705,62.23; 82 50.165,62.23; 83 52.705,64.77; 84 50.165,64.77; 85 52.705,67.31; 86 50.165,67.31; 87 52.705,69.85; 88 50.165,69.85; 89 52.705,72.39; 90 50.165,72.39; 91 52.705,74.93; 92 50.165,74.93

### Placement (x,y rotation side)
C1  29.21,31.11 270 top
C2  29.21,37.47 270 top
C3  8.89,52.7 270 top
C4  43.18,52.7 270 top
C5  43.18,45.72 90 top
C6  19.05,47.62 90 top
C7  15.24,32.39 270 top
C8  45.72,6.98 270 top
C9  20.32,38.73 90 top
D1  40.64,52.7 0 top
D2  13.97,52.7 0 top
D3  39.37,45.72 180 top
D4  15.24,47.62 180 top
D5  17.14,38.73 0 top
D7  14.61,38.73 90 top
IC1  35.56,31.11 90 top
IC2  35.56,37.47 90 top
IC3  12.7,34.92 270 top
LED1  36.83,52.7 180 top
LED2  16.51,52.7 180 top
LED3  19.05,28.57 270 top
LED4  39.37,8.25 270 top
LED5  31.75,8.25 90 top
LED6  22.86,8.25 270 top
LED7  15.24,8.25 270 top
PAD1  48.26,65.41 0 top
PAD2  31.75,69.21 90 top
PAD3  6.35,65.41 0 top
PAD4  22.86,69.21 90 top
PAD5  45.72,26.04 90 top
PAD6  45.72,14.61 0 top
PAD7  45.72,18.42 0 top
PAD8  8.89,26.04 90 top
PAD9  8.89,14.61 0 top
PAD10  8.89,18.42 270 top
PAD11  8.89,22.22 90 top
PAD12  45.72,22.22 0 top
PAD13  11.43,43.18 90 top
PAD14  18.41,43.18 90 top
Q1  40.64,14.61 180 top
Q2  31.11,14.61 180 top
Q3  23.5,14.61 180 top
Q4  13.97,14.61 180 top
Q5  40.64,20.96 0 top
Q6  13.97,20.96 180 top
Q7  29.21,52.7 0 top
Q8  25.4,52.7 0 top
R1  36.83,14.61 90 top
R2  34.29,14.61 90 top
R3  20.32,14.61 90 top
R4  17.78,14.61 90 top
R5  36.83,20.96 270 top
R6  17.78,20.96 90 top
R7  11.43,52.7 90 top
R9  21.59,52.7 270 top
R11  45.72,52.7 90 top
R12  19.05,52.7 270 top
R13  45.72,45.72 90 top
R14  31.75,52.7 270 top
R15  34.29,52.7 270 top
R16  35.56,45.72 90 top
R17  8.89,47.62 90 top
R18  11.43,47.62 90 top
R19  15.24,28.57 180 top
R20  39.37,10.79 0 top
R21  31.75,10.79 180 top
R22  22.86,10.79 0 top
R23  15.24,10.79 0 top
R24  17.78,32.39 90 top
R25  20.32,32.39 270 top
U1  36.83,62.86 0 top
U2  17.78,62.86 180 top
U$1  0,-14.61 0 top

### Tracks (layer width: path | path; a pad name or v marks a point on that pad's centre or on a via)
+3V3  (via drill 0.5, 0.9)
  Top 0.305: R1.2 35.77,15.45 35.56,15.24 | 35.56,15.24 v35.56,12.7 | R2.2 35.34,15.45 35.56,15.24 | R4.2 17.78,15.88 19.68,17.78 20.32,17.78 | 20.32,17.78 27.3,17.78 v28.57,16.51 | R3.2 20.32,17.78 | R6.2 17.78,22.22 19.05,23.5 28.57,23.5 v29.21,22.86 31.96,20.11 R5.2
  Top 0.406: 35.56,32.39 v35.56,34.29 35.56,34.92 | 35.56,32.39 34.92,31.75 32.38,31.75 | IC1.1 36.2,29.21 35.56,29.85 35.56,32.39 | IC2.6 34.92,38.1 35.56,37.47 35.56,34.92 | IC2.1 36.2,35.56 35.56,34.92
  Top 0.61: IC2.6 29.43,38.1 C2.1 | IC1.6 32.38,31.75 29.43,31.75 C1.1
  Bottom 0.305: v35.56,12.7 35.56,10.79 | v28.57,16.51 27.3,16.51 | v29.21,22.86 27.3,22.86
  Bottom 1.016: U$1.49 U$1.50 46.35,10.79 35.56,10.79 29.21,10.79 27.3,12.7 27.3,16.51 27.3,22.86 27.3,31.75 29.84,34.29 v35.56,34.29
+5V  (via drill 0.9)
  Top 0.305: IC3.3 12.7,32.39 13.34,31.75 13.34,29.21 13.97,28.57 R19.2
  Top 1.016: C8.1 45.72,8.25 46.67,9.21 | 46.67,9.21 46.99,9.52 U$1.52 U$1.51 | v43.18,8.89 43.81,9.52 46.35,9.52 46.67,9.21
  Bottom 1.016: IC3.3 22.86,32.39 26.04,29.21 26.04,12.07 28.57,9.52 42.55,9.52 v43.18,8.89
GND  (via drill 0.5)
  other vias: 44.45,51.44 38.1,51.44 38.1,53.97 31.11,57.15 36.2,56.52 43.18,56.52 47.62,57.78 47.62,60.96 51.44,63.5 9.53,55.88 15.24,55.88 22.23,55.88 6.99,60.33 2.54,62.86 41.91,45.72 43.18,42.55 35.56,42.55 28.57,42.55 23.5,45.08 23.5,43.18 23.5,41.28 28.57,46.36 7.62,45.08 7.62,41.28 7.62,29.21 6.99,33.66 6.99,36.19 17.78,35.56 22.23,29.85 22.86,35.56 26.67,37.47 26.67,33.66 29.21,27.94 33.02,25.4 41.27,25.4 29.21,20.32 24.13,20.32 19.68,20.32 45.72,28.57 43.18,14.61 43.18,5.08 26.67,8.89 19.05,8.25 12.06,5.08 41.27,34.92 46.99,34.92 47.62,41.28 27.3,66.04 27.3,57.78 42.55,69.85 38.1,69.85 16.51,69.85 10.79,69.85 33.02,50.8 26.67,50.16 31.11,17.14 38.1,14.61 38.1,12.7 11.43,21.59 11.43,15.88
  pour Bottom: 0,-0.63 0,76.83 54.61,76.83 54.61,-0.63
  pour Top: 0,-0.63 0,71.75 58.42,71.75 58.42,-0.63
GPIO_48  (via drill 0.5)
  Top 0.305: R22.2 23.71,11.64 24.77,12.7 24.77,15.38 Q3.1 24.45,16.82 24.77,17.14 26.67,17.14 v28.57,15.24
  Bottom 0.305: U$1.61 51.44,20.96 48.26,20.96 47.62,20.32 44.45,20.32 41.27,17.14 34.67,17.14 32.77,15.24 v28.57,15.24
GPIO_50  (via drill 0.5)
  Top 0.305: Q2.1 32.06,14.92 31.75,14.61 30.48,14.61 29.84,13.97 | 29.84,13.97 29.84,11.43 30.48,10.79 R21.2 | v28.57,13.97 29.84,13.97
  Bottom 0.305: U$1.60 46.99,16.51 34.92,16.51 32.38,13.97 v28.57,13.97
GPIO_51  (via drill 0.5)
  Top 0.305: U$1.62 48.26,20.32 44.45,20.32 41.91,17.78 32.38,17.78 31.75,18.42 16.51,18.42 14.92,16.82 Q4.1 15.88,14.75 v15.88,14.61 | R23.2 v17.78,10.79
  Bottom 0.305: v17.78,10.79 16.51,10.79 15.88,11.43 v15.88,14.61
GPIO_60
  Top 0.305: Q1.1 42.38,15.7 43.18,16.51 46.99,16.51 | 46.99,16.51 47.62,15.88 47.62,11.43 46.99,10.79 R20.2 | U$1.58 47.62,17.14 46.99,16.51
MOTOR0_EN
  Top 0.305: Q7.1 28.26,52.39 28.57,52.7 30.9,52.7 R14.2 R15.2 34.51,51.85 36.2,50.16 48.26,50.16 49.53,51.44 50.8,51.44 51.44,52.07 51.44,53.97 U$1.88
MOTOR0_FWD
  Top 0.305: R1.1 40.39,13.75 Q1.3 44.62,13.5 PAD6.1
MOTOR0_HS
  Top 1.143: U1.7 34.29,59.05 35.56,60.33 | 35.56,60.33 35.56,67.94 34.29,69.21 PAD2.1 | U1.6 35.56,60.33 | 32.26,68.71 PAD2.1 | U1.2 30.48,65.41 29.21,66.67 | 29.21,66.67 29.21,67.94 30.48,69.21 PAD2.1 | U1.1 29.21,66.67
MOTOR0_REV
  Top 0.305: R2.1 33.02,13.75 | 33.02,13.75 32.8,13.75 32.38,13.34 31.29,13.34 Q2.3 | PAD7.1 43.81,18.42 42.55,17.14 33.66,17.14 33.02,16.51 33.02,13.75
MOTOR0_SENSE_AD
  Top 0.305: U1.5 29.84,61.59 29.21,60.96 29.21,55.88 29.84,55.24 40.01,55.24 40.64,54.61 D1.3 42.93,53.8 C4.1 R11.2 49.31,53.55 U$1.86
MOTOR0_TACH
  Top 0.305: 45.55,22.05 PAD12.1 44.45,20.96 40.64,20.96 39.69,20 Q5.1
MOTOR0_TACH_FILT
  Top 0.305: U$1.15 5.08,22.22 6.99,24.13 29.21,24.13 31.54,21.8 R5.1 37.08,22.05 Q5.3
MOTOR0_TRIGGER
  Top 0.305: IC1.8 34.92,29.21 36.2,27.94 43.81,27.94 PAD5.1
MOTOR1_EN  (via drill 0.5)
  Top 0.305: R12.2 R9.2 21.84,51.6 Q8.1 24.45,49.84 25.4,48.89 46.99,48.89 v47.62,48.26
  Bottom 0.305: v47.62,48.26 47.62,52.7 49.53,53.97 51.44,53.97 U$1.87
MOTOR1_FWD
  Top 0.305: PAD9.1 11.43,12.07 18.63,12.07 R3.1 20.54,13.97 20.95,13.97 21.59,14.61 21.59,16.51 22.23,17.14 23.11,17.14 23.58,16.68 23.58,13.59 Q3.3
MOTOR1_HS
  Top 1.016: 20.32,69.21 PAD4.1
  Top 1.143: U2.1 20.32,59.05 19.05,60.33 | 19.05,60.33 19.05,67.94 20.32,69.21 | U2.2 19.05,60.33 | U2.6 24.13,65.41 25.4,66.67 | 25.4,66.67 25.4,67.94 24.13,69.21 PAD4.1 | U2.7 25.4,66.67
MOTOR1_REV
  Top 0.305: PAD10.1 9.53,17.78 13.34,17.78 13.97,17.14 Q4.3 17.53,13.5 R4.1
MOTOR1_SENSE_AD
  Top 0.305: U2.5 24.77,64.13 26.04,62.86 26.04,55.24 26.67,54.61 26.67,53.34 | 26.67,53.34 26.04,52.7 14.61,52.7 13.97,53.34 D2.3 11.68,53.8 R7.2 C3.1 | 26.67,53.34 27.3,52.7 27.3,50.8 28.57,49.53 49.53,49.53 U$1.84
MOTOR1_TACH
  Top 0.305: PAD11.1 10.16,22.22 11.43,23.5 13.48,23.5 Q6.1
MOTOR1_TACH_FILT
  Top 0.305: U$1.16 3.17,20.96 5.71,20.96 6.35,20.32 12.7,20.32 13.34,19.68 13.8,19.68 Q6.3 17.53,19.86 R6.1
MOTOR1_TRIGGER
  Top 0.305: PAD8.1 22.86,26.04 24.77,27.94 24.77,33.66 26.67,35.56 IC2.8
N$2
  Top 0.305: U2.3 24.77,61.59 25.4,60.96 Q8.3
N$3
  Top 0.305: R12.1 16.61,53.55 LED2.A
N$4
  Top 0.305: 32.38,64.13 31.75,64.13
N$5
  Top 0.305: U1.3 29.84,64.13 28.57,62.86 28.57,55.24 29.21,54.61 Q7.3
N$6
  Top 0.305: R15.1 36.73,53.55 LED1.A
N$7
  Top 0.305: R19.1 LED3.A
N$8
  Top 0.305: R20.1 38.52,8.36 LED4.A
N$9
  Top 0.305: R21.1 32.6,8.36 LED5.A
N$10
  Top 0.305: R22.1 22.01,8.36 LED6.A
N$11
  Top 0.305: R23.1 14.39,8.36 LED7.A
SPI0_CS
  Top 0.305: U$1.63 51.44,26.04 49.53,26.04 48.9,26.67 48.9,29.21 47.62,30.48 IC1.2
SPI0_MOSI
  Top 0.305: U$1.67 51.44,31.11 49.53,31.11 47.62,33.02 IC1.4
SPI0_SCLK
  Top 0.305: U$1.68 49.53,29.85 47.62,31.75 IC1.3
SPI1_CS
  Top 0.305: U$1.74 49.53,37.47 48.9,36.83 IC2.2
SPI1_MOSI
  Top 0.305: IC2.4 48.9,39.37 49.53,38.73 51.44,38.73 U$1.75
SPI1_SCLK  (via drill 0.5)
  Top 0.305: IC2.3 v47.62,38.1
  Bottom 0.305: v47.62,38.1 48.9,38.1 49.53,38.73 50.8,38.73 51.44,39.37 51.44,41.28 U$1.77
VBATT
  Top 0.61: PAD13.1 12.7,43.18 14.61,41.28 D7.A
VBATT_FILT
  Top 0.305: D7.C 14.61,34.92 15.24,34.29 C7.1 17.68,33.33 R24.2
  Top 0.61: D7.C 11.45,37.48 11.43,37.47 IC3.1
VBATT_SENSE_AD
  Top 0.305: R24.1 18.84,31.54 19.05,31.75 19.05,32.39 19.68,33.02 20.11,33.02 R25.1 C9.1 19.27,37.89 19.05,38.1 19.05,39.37 18.41,40 17.32,40 D5.3
  Top 0.406: C9.1 23.91,37.89 26.67,40.64 45.09,40.64 48.26,43.81 51.44,43.81 U$1.79
VCC  (via drill 0.5)
  Top 0.305: v46.35,55.88 46.35,57.91 U1.8 | R13.2 46.77,46.57 v47.62,45.72
  Top 3.81: PAD1.1 41.41,65.41 U1.8
  Bottom 0.305: v46.35,55.88 46.35,46.99 v47.62,45.72
VCC_SENSE_AD
  Top 0.305: R16.1 35.81,44.62 D3.3 39.62,44.87 C5.1 R13.1 48.05,44.87 49.53,46.36 50.8,46.36 51.44,46.99 51.44,48.26 52.7,49.53 U$1.83
VDD
  Top 0.305: R17.2 8.04,48.47 6.99,49.53 6.99,56.64 U2.8
  Top 3.81: PAD3.1 13.21,65.41 U2.8
VDD_SENSE_AD
  Top 0.305: R17.1 R18.1 14.99,46.78 D4.3 18.8,46.53 C6.1 26.45,46.78 27.94,48.26 46.35,48.26 47.62,46.99 48.26,46.99 48.9,47.62 48.9,48.26 49.53,48.89 50.8,48.89 51.44,49.53 51.44,50.8 52.7,52.07 U$1.85